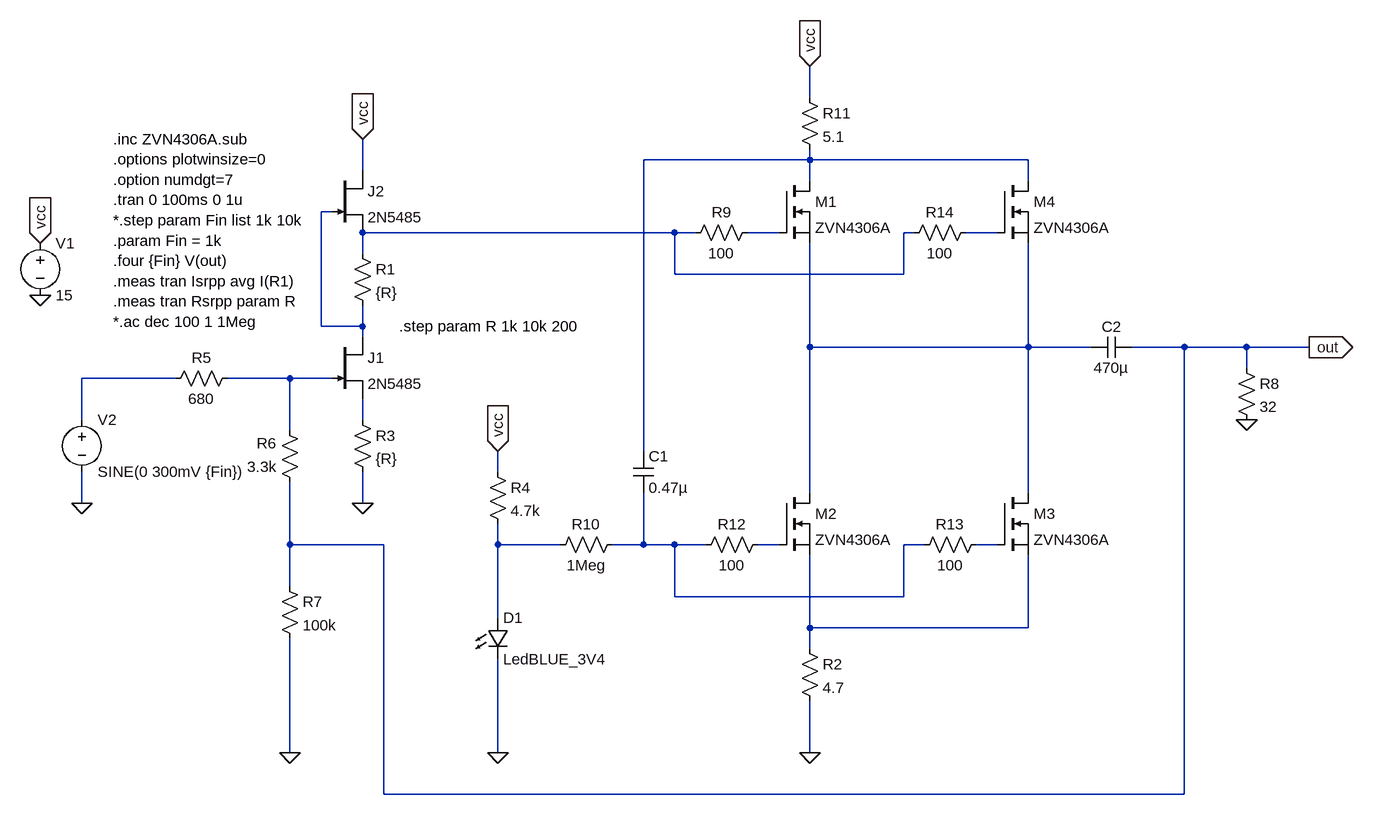
[diagram p0: schematic FET Only 2.asc]
FET Only 2.asc, the LTspice schematic file:
Version 4
SHEET 1 1908 964
WIRE 1056 -112 1056 -160
WIRE 1056 -16 1056 -32
WIRE 1056 -16 800 -16
WIRE 1392 -16 1056 -16
WIRE 368 0 368 -48
WIRE 1056 16 1056 -16
WIRE 1392 16 1392 -16
WIRE 320 64 304 64
WIRE 848 96 368 96
WIRE 880 96 848 96
WIRE 1008 96 960 96
WIRE 1216 96 1200 96
WIRE 1344 96 1296 96
WIRE 368 128 368 96
WIRE 848 160 848 96
WIRE 1200 160 1200 96
WIRE 1200 160 848 160
WIRE 304 240 304 64
WIRE 368 240 368 208
WIRE 368 240 304 240
WIRE 368 256 368 240
WIRE 1056 272 1056 112
WIRE 1392 272 1392 112
WIRE 1392 272 1056 272
WIRE 1488 272 1392 272
WIRE 1632 272 1552 272
WIRE 1728 272 1632 272
WIRE 1824 272 1728 272
WIRE 1728 304 1728 272
WIRE 80 320 -64 320
WIRE 256 320 160 320
WIRE 320 320 256 320
WIRE -64 384 -64 320
WIRE 368 384 368 352
WIRE 256 400 256 320
WIRE 800 432 800 -16
WIRE 576 464 576 432
WIRE 1056 496 1056 272
WIRE 1392 496 1392 272
WIRE -64 512 -64 464
WIRE 368 512 368 464
WIRE 256 576 256 480
WIRE 400 576 256 576
WIRE 576 576 576 544
WIRE 672 576 576 576
WIRE 800 576 800 496
WIRE 800 576 752 576
WIRE 848 576 800 576
WIRE 896 576 848 576
WIRE 1008 576 976 576
WIRE 1232 576 1200 576
WIRE 1344 576 1312 576
WIRE 256 640 256 576
WIRE 848 656 848 576
WIRE 1200 656 1200 576
WIRE 1200 656 848 656
WIRE 576 688 576 576
WIRE 1056 704 1056 592
WIRE 1392 704 1392 592
WIRE 1392 704 1056 704
WIRE 1056 736 1056 704
WIRE 256 896 256 720
WIRE 576 896 576 752
WIRE 1056 896 1056 816
WIRE 400 960 400 576
WIRE 1632 960 1632 272
WIRE 1632 960 400 960
FLAG 368 512 0
FLAG -64 512 0
FLAG -128 112 vcc
IOPIN -128 112 In
FLAG -128 192 0
FLAG 368 -48 vcc
IOPIN 368 -48 In
FLAG 1056 -160 vcc
IOPIN 1056 -160 In
FLAG 1056 896 0
FLAG 576 432 vcc
IOPIN 576 432 In
FLAG 576 896 0
FLAG 1824 272 out
IOPIN 1824 272 Out
FLAG 256 896 0
FLAG 1728 384 0
SYMBOL voltage -64 368 R0
SYMATTR InstName V2
SYMATTR Value SINE(0 300mV {Fin})
SYMATTR Value2 AC 1
SYMBOL voltage -128 96 R0
SYMATTR InstName V1
SYMATTR Value 15
SYMBOL res 352 368 R0
SYMATTR InstName R3
SYMATTR Value {R}
SYMBOL njf 320 256 R0
SYMATTR InstName J1
SYMATTR Value 2N5485
SYMBOL res 352 112 R0
SYMATTR InstName R1
SYMATTR Value {R}
SYMBOL njf 320 0 R0
SYMATTR InstName J2
SYMATTR Value 2N5485
SYMBOL res 1040 720 R0
SYMATTR InstName R2
SYMATTR Value 4.7
SYMBOL res 560 448 R0
SYMATTR InstName R4
SYMATTR Value 4.7k
SYMBOL nmos 1008 16 R0
SYMATTR InstName M1
SYMATTR Value ZVN4306A
SYMATTR Prefix X
SYMBOL res 176 304 R90
WINDOW 0 0 56 VBottom 2
WINDOW 3 32 56 VTop 2
SYMATTR InstName R5
SYMATTR Value 680
SYMBOL res 272 496 R180
WINDOW 0 36 76 Left 2
WINDOW 3 36 40 Left 2
SYMATTR InstName R6
SYMATTR Value 3.3k
SYMBOL res 240 624 R0
SYMATTR InstName R7
SYMATTR Value 100k
SYMBOL cap 1552 256 R90
WINDOW 0 0 32 VBottom 2
WINDOW 3 32 32 VTop 2
SYMATTR InstName C2
SYMATTR Value 470µ
SYMBOL res 1712 288 R0
SYMATTR InstName R8
SYMATTR Value 32
SYMBOL res 976 80 R90
WINDOW 0 0 56 VBottom 2
WINDOW 3 32 56 VTop 2
SYMATTR InstName R9
SYMATTR Value 100
SYMBOL res 768 560 R90
WINDOW 0 0 56 VBottom 2
WINDOW 3 32 56 VTop 2
SYMATTR InstName R10
SYMATTR Value 1Meg
SYMBOL res 1040 -128 R0
SYMATTR InstName R11
SYMATTR Value 5.1
SYMBOL cap 784 432 R0
SYMATTR InstName C1
SYMATTR Value 0.47µ
SYMBOL nmos 1008 496 R0
SYMATTR InstName M2
SYMATTR Value ZVN4306A
SYMATTR Prefix X
SYMBOL LED 560 688 R0
SYMATTR InstName D1
SYMATTR Value LedBLUE_3V4
SYMBOL res 992 560 R90
WINDOW 0 0 56 VBottom 2
WINDOW 3 32 56 VTop 2
SYMATTR InstName R12
SYMATTR Value 100
SYMBOL nmos 1344 496 R0
SYMATTR InstName M3
SYMATTR Value ZVN4306A
SYMATTR Prefix X
SYMBOL res 1328 560 R90
WINDOW 0 0 56 VBottom 2
WINDOW 3 32 56 VTop 2
SYMATTR InstName R13
SYMATTR Value 100
SYMBOL nmos 1344 16 R0
SYMATTR InstName M4
SYMATTR Value ZVN4306A
SYMATTR Prefix X
SYMBOL res 1312 80 R90
WINDOW 0 0 56 VBottom 2
WINDOW 3 32 56 VTop 2
SYMATTR InstName R14
SYMATTR Value 100
TEXT -16 -48 Left 2 !.inc ZVN4306A.sub\n.options plotwinsize=0\n.option numdgt=7\n.tran 0 100ms 0 1u\n*.step param Fin list 1k 10k\n.param Fin = 1k\n.four {Fin} V(out)\n.meas tran Isrpp avg I(R1)\n.meas tran Rsrpp param R\n*.ac dec 100 1 1Meg
TEXT 424 240 Left 2 !.step param R 1k 10k 200

The netlist it stands for:
* FET Only 2.asc
V2 N007 0 SINE(0 300mV {Fin}) AC 1
V1 vcc 0 15
R3 N009 0 {R}
J1 N002 N008 N009 2N5485
R1 N003 N002 {R}
J2 vcc N002 N003 2N5485
R2 N014 0 4.7
R4 vcc N010 4.7k
XM1 N001 N004 N006 ZVN4306A  ; pins D G S
R5 N008 N007 680
R6 out N008 3.3k
R7 out 0 100k
C2 out N006 470µ
R8 out 0 32
R9 N004 N003 100
R10 N011 N010 1Meg
R11 vcc N001 5.1
C1 N001 N011 0.47µ
XM2 N006 N012 N014 ZVN4306A  ; pins D G S
D1 N010 0 LedBLUE_3V4
R12 N012 N011 100
XM3 N006 N013 N014 ZVN4306A  ; pins D G S
R13 N013 N011 100
XM4 N001 N005 N006 ZVN4306A  ; pins D G S
R14 N005 N003 100
.model D D
.lib standard.dio
.model NJF NJF
.model PJF PJF
.lib standard.jft
.inc ZVN4306A.sub
.options plotwinsize=0
.option numdgt=7
.tran 0 100ms 0 1u
*.step param Fin list 1k 10k
.param Fin = 1k
.four {Fin} V(out)
.meas tran Isrpp avg I(R1)
.meas tran Rsrpp param R
*.ac dec 100 1 1Meg
.step param R 1k 10k 200
.backanno
.end